# Altium schematic sheet logique.SchDoc
size A3
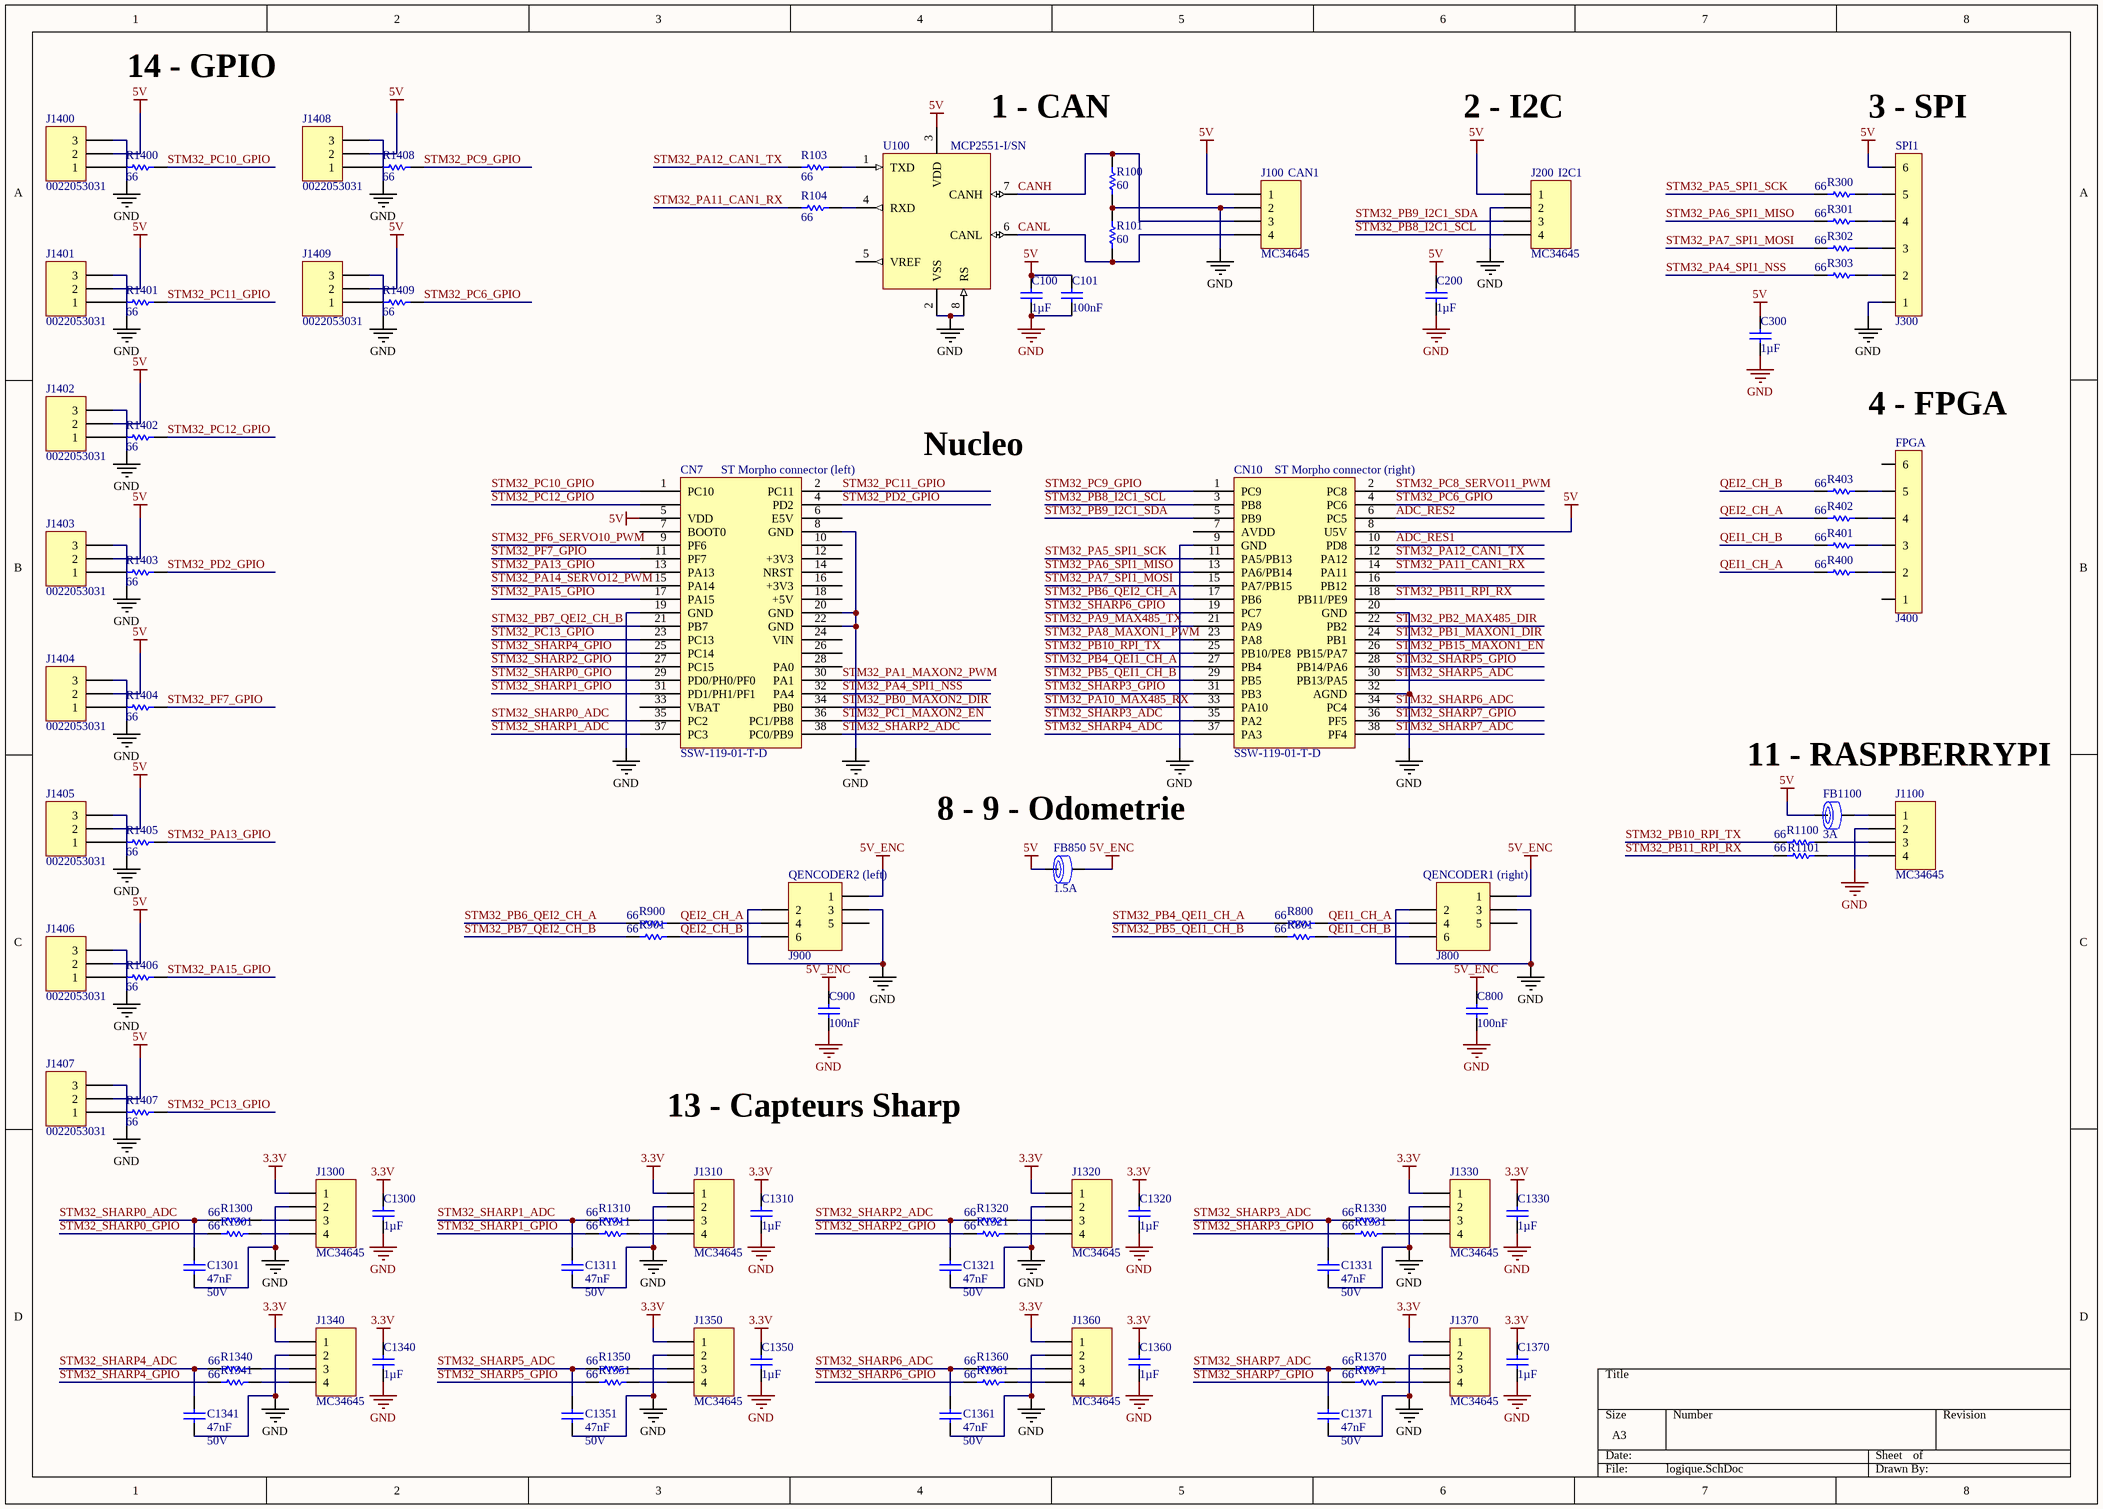
[diagram p0: logique.SchDoc]

## Parts
C100  1µF  [C0805_N]
C101  100nF  [C0805_N]
C200  1µF  [C0805_N]
C300  1µF  [C0805_N]
C800  100nF  [C0805_N]
C900  100nF  [C0805_N]
C1300  1µF  [C0805_N]
C1301  47nF  RatedVoltage: 50V  [WCAP-CSGP_0603, 1.6x0.8x0.8]
C1310  1µF  [C0805_N]
C1311  47nF  RatedVoltage: 50V  [WCAP-CSGP_0603, 1.6x0.8x0.8]
C1320  1µF  [C0805_N]
C1321  47nF  RatedVoltage: 50V  [WCAP-CSGP_0603, 1.6x0.8x0.8]
C1330  1µF  [C0805_N]
C1331  47nF  RatedVoltage: 50V  [WCAP-CSGP_0603, 1.6x0.8x0.8]
C1340  1µF  [C0805_N]
C1341  47nF  RatedVoltage: 50V  [WCAP-CSGP_0603, 1.6x0.8x0.8]
C1350  1µF  [C0805_N]
C1351  47nF  RatedVoltage: 50V  [WCAP-CSGP_0603, 1.6x0.8x0.8]
C1360  1µF  [C0805_N]
C1361  47nF  RatedVoltage: 50V  [WCAP-CSGP_0603, 1.6x0.8x0.8]
C1370  1µF  [C0805_N]
C1371  47nF  RatedVoltage: 50V  [WCAP-CSGP_0603, 1.6x0.8x0.8]
CN7  SSW-119-01-T-D  [CONN RCPT .100" 38POS DUAL TIN]
CN10  SSW-119-01-T-D  [CONN RCPT .100" 38POS DUAL TIN]
FB850  RatedCurrent: 1.5A  [WE-CBF_0603_High Current]  (hidden comment: 742792624)
FB1100  RatedCurrent: 3A  [WE-CBF_0805_High Current]  (hidden comment: 742792023)
J100  MC34645  [HDR1X4]
J200  MC34645  [HDR1X4]
J300  22-03-2061  [22-03-2061]  (value not drawn)
J400  22-03-2061  [22-03-2061]  (value not drawn)
J800  (no value)  [690367280676]
J900  (no value)  [690367280676]
J1100  MC34645  [HDR1X4]
J1300  MC34645  [HDR1X4]
J1310  MC34645  [HDR1X4]
J1320  MC34645  [HDR1X4]
J1330  MC34645  [HDR1X4]
J1340  MC34645  [HDR1X4]
J1350  MC34645  [HDR1X4]
J1360  MC34645  [HDR1X4]
J1370  MC34645  [HDR1X4]
J1400  0022053031  [HDR1X3]
J1401  0022053031  [HDR1X3]
J1402  0022053031  [HDR1X3]
J1403  0022053031  [HDR1X3]
J1404  0022053031  [HDR1X3]
J1405  0022053031  [HDR1X3]
J1406  0022053031  [HDR1X3]
J1407  0022053031  [HDR1X3]
J1408  0022053031  [HDR1X3]
J1409  0022053031  [HDR1X3]
R100  60  [R0805_N]
R101  60  [R0805_N]
R103  66  [R0805_N]
R104  66  [R0805_N]
R300  66  [R0805_N]
R301  66  [R0805_N]
R302  66  [R0805_N]
R303  66  [R0805_N]
R400  66  [R0805_N]
R401  66  [R0805_N]
R402  66  [R0805_N]
R403  66  [R0805_N]
R800  66  [R0805_N]
R801  66  [R0805_N]
R900  66  [R0805_N]
R901  66  [R0805_N]
R1100  66  [R0805_N]
R1101  66  [R0805_N]
R1300  66  [R0805_N]
R1301  66  [R0805_N]
R1310  66  [R0805_N]
R1311  66  [R0805_N]
R1320  66  [R0805_N]
R1321  66  [R0805_N]
R1330  66  [R0805_N]
R1331  66  [R0805_N]
R1340  66  [R0805_N]
R1341  66  [R0805_N]
R1350  66  [R0805_N]
R1351  66  [R0805_N]
R1360  66  [R0805_N]
R1361  66  [R0805_N]
R1370  66  [R0805_N]
R1371  66  [R0805_N]
R1400  66  [R0805_N]
R1401  66  [R0805_N]
R1402  66  [R0805_N]
R1403  66  [R0805_N]
R1404  66  [R0805_N]
R1405  66  [R0805_N]
R1406  66  [R0805_N]
R1407  66  [R0805_N]
R1408  66  [R0805_N]
R1409  66  [R0805_N]
U100  MCP2551-I/SN  [SO8_N]

## Nets
3.3V: C1300.2 C1310.2 C1320.2 C1330.2 C1340.2 C1350.2 C1360.2 C1370.2 J1300.1 J1310.1 J1320.1 J1330.1 J1340.1 J1350.1 J1360.1 J1370.1
5V: C100.2 C101.2 C200.2 C300.2 CN7.5(VDD) CN10.8(U5V) FB850.1 FB1100.1 J100.1 J200.1 J300.6 J1400.2 J1401.2 J1402.2 J1403.2 J1404.2 J1405.2 J1406.2 J1407.2 J1408.2 J1409.2 U100.3(VDD)
5V_ENC: C800.2 C900.2 FB850.2 J800.1 J900.1
GND: C100.1 C101.1 C200.1 C300.1 C800.1 C900.1 C1300.1 C1301.1 C1310.1 C1311.1 C1320.1 C1321.1 C1330.1 C1331.1 C1340.1 C1341.1 C1350.1 C1351.1 C1360.1 C1361.1 C1370.1 C1371.1 CN7.8(GND) CN7.19(GND) CN7.20(GND) CN7.22(GND) CN10.9(GND) CN10.20(GND) CN10.32(AGND) J100.2 J200.2 J300.1 J800.2 J800.3 J900.2 J900.3 J1100.2 J1300.2 J1310.2 J1320.2 J1330.2 J1340.2 J1350.2 J1360.2 J1370.2 J1400.3 J1401.3 J1402.3 J1403.3 J1404.3 J1405.3 J1406.3 J1407.3 J1408.3 J1409.3 R100.1 R101.2 U100.2(VSS) U100.8(RS)
ADC_RES1: CN10.10(PD8)
ADC_RES2: CN10.6(PC5)
CANH: J100.3 R100.2 U100.7(CANH)
CANL: J100.4 R101.1 U100.6(CANL)
QEI1_CH_A: J800.4 R400.2 R800.1
QEI1_CH_B: J800.6 R401.2 R801.1
QEI2_CH_A: J900.4 R402.2 R900.1
QEI2_CH_B: J900.6 R403.2 R901.1
STM32_PA1_MAXON2_PWM: CN7.30(PA1)
STM32_PA4_SPI1_NSS: CN7.32(PA4) R303.2
STM32_PA5_SPI1_SCK: CN10.11(PA5/PB13) R300.2
STM32_PA6_SPI1_MISO: CN10.13(PA6/PB14) R301.2
STM32_PA7_SPI1_MOSI: CN10.15(PA7/PB15) R302.2
STM32_PA8_MAXON1_PWM: CN10.23(PA8)
STM32_PA9_MAX485_TX: CN10.21(PA9)
STM32_PA10_MAX485_RX: CN10.33(PA10)
STM32_PA11_CAN1_RX: CN10.14(PA11) R104.2
STM32_PA12_CAN1_TX: CN10.12(PA12) R103.2
STM32_PA13_GPIO: CN7.13(PA13) R1405.1
STM32_PA14_SERVO12_PWM: CN7.15(PA14)
STM32_PA15_GPIO: CN7.17(PA15) R1406.1
STM32_PB0_MAXON2_DIR: CN7.34(PB0)
STM32_PB1_MAXON1_DIR: CN10.24(PB1)
STM32_PB2_MAX485_DIR: CN10.22(PB2)
STM32_PB4_QEI1_CH_A: CN10.27(PB4) R800.2
STM32_PB5_QEI1_CH_B: CN10.29(PB5) R801.2
STM32_PB6_QEI2_CH_A: CN10.17(PB6) R900.2
STM32_PB7_QEI2_CH_B: CN7.21(PB7) R901.2
STM32_PB8_I2C1_SCL: CN10.3(PB8) J200.4
STM32_PB9_I2C1_SDA: CN10.5(PB9) J200.3
STM32_PB10_RPI_TX: CN10.25(PB10/PE8) R1100.2
STM32_PB11_RPI_RX: CN10.18(PB11/PE9) R1101.2
STM32_PB15_MAXON1_EN: CN10.26(PB15/PA7)
STM32_PC1_MAXON2_EN: CN7.36(PC1/PB8)
STM32_PC6_GPIO: CN10.4(PC6) R1409.1
STM32_PC8_SERVO11_PWM: CN10.2(PC8)
STM32_PC9_GPIO: CN10.1(PC9) R1408.1
STM32_PC10_GPIO: CN7.1(PC10) R1400.1
STM32_PC11_GPIO: CN7.2(PC11) R1401.1
STM32_PC12_GPIO: CN7.3(PC12) R1402.1
STM32_PC13_GPIO: CN7.23(PC13) R1407.1
STM32_PD2_GPIO: CN7.4(PD2) R1403.1
STM32_PF6_SERVO10_PWM: CN7.9(PF6)
STM32_PF7_GPIO: CN7.11(PF7) R1404.1
STM32_SHARP0_ADC: C1301.2 CN7.35(PC2) R1300.2
STM32_SHARP0_GPIO: CN7.29(PD0/PH0/PF0) R1301.2
STM32_SHARP1_ADC: C1311.2 CN7.37(PC3) R1310.2
STM32_SHARP1_GPIO: CN7.31(PD1/PH1/PF1) R1311.2
STM32_SHARP2_ADC: C1321.2 CN7.38(PC0/PB9) R1320.2
STM32_SHARP2_GPIO: CN7.27(PC15) R1321.2
STM32_SHARP3_ADC: C1331.2 CN10.35(PA2) R1330.2
STM32_SHARP3_GPIO: CN10.31(PB3) R1331.2
STM32_SHARP4_ADC: C1341.2 CN10.37(PA3) R1340.2
STM32_SHARP4_GPIO: CN7.25(PC14) R1341.2
STM32_SHARP5_ADC: C1351.2 CN10.30(PB13/PA5) R1350.2
STM32_SHARP5_GPIO: CN10.28(PB14/PA6) R1351.2
STM32_SHARP6_ADC: C1361.2 CN10.34(PC4) R1360.2
STM32_SHARP6_GPIO: CN10.19(PC7) R1361.2
STM32_SHARP7_ADC: C1371.2 CN10.38(PF4) R1370.2
STM32_SHARP7_GPIO: CN10.36(PF5) R1371.2
NetFB1100_2: FB1100.2 J1100.1
NetJ300_2: J300.2 R303.1
NetJ300_3: J300.3 R302.1
NetJ300_4: J300.4 R301.1
NetJ300_5: J300.5 R300.1
NetJ400_2: J400.2 R400.1
NetJ400_3: J400.3 R401.1
NetJ400_4: J400.4 R402.1
NetJ400_5: J400.5 R403.1
NetJ1100_3: J1100.3 R1100.1
NetJ1100_4: J1100.4 R1101.1
NetJ1300_3: J1300.3 R1300.1
NetJ1300_4: J1300.4 R1301.1
NetJ1310_3: J1310.3 R1310.1
NetJ1310_4: J1310.4 R1311.1
NetJ1320_3: J1320.3 R1320.1
NetJ1320_4: J1320.4 R1321.1
NetJ1330_3: J1330.3 R1330.1
NetJ1330_4: J1330.4 R1331.1
NetJ1340_3: J1340.3 R1340.1
NetJ1340_4: J1340.4 R1341.1
NetJ1350_3: J1350.3 R1350.1
NetJ1350_4: J1350.4 R1351.1
NetJ1360_3: J1360.3 R1360.1
NetJ1360_4: J1360.4 R1361.1
NetJ1370_3: J1370.3 R1370.1
NetJ1370_4: J1370.4 R1371.1
NetJ1400_1: J1400.1 R1400.2
NetJ1401_1: J1401.1 R1401.2
NetJ1402_1: J1402.1 R1402.2
NetJ1403_1: J1403.1 R1403.2
NetJ1404_1: J1404.1 R1404.2
NetJ1405_1: J1405.1 R1405.2
NetJ1406_1: J1406.1 R1406.2
NetJ1407_1: J1407.1 R1407.2
NetJ1408_1: J1408.1 R1408.2
NetJ1409_1: J1409.1 R1409.2
NetR103_1: R103.1 U100.1(TXD)
NetR104_1: R104.1 U100.4(RXD)

Not connected (* = marked no-connect by the designer): CN7 6(E5V) 7(BOOT0) 10 12(+3V3) 14(NRST) 16(+3V3) 18(+5V) 24(VIN) 26 28(PA0) 33(VBAT); CN10 7(AVDD) 16(PB12); J400 1 6; J800 5; J900 5; U100 5(VREF)

## Notes on the sheet
- 14 - GPIO
- 1 - CAN
- (near J100) CAN1
- 2 - I2C
- (near J200) I2C1
- (near J300) 3 - SPI
- (near J300) SPI1
- (near J400) 4 - FPGA
- (near J400) FPGA
- (near CN7) ST Morpho connector (left)
- Nucleo
- (near CN10) ST Morpho connector (right)
- 11 - RASPBERRYPI
- 8 - 9 - Odometrie
- (near J900) QENCODER2 (left)
- (near J800) QENCODER1 (right)
- 13 - Capteurs Sharp

## Library data of the parts
C100 C101 C200 C300 C800 C900 C1300 C1310 C1320 C1330 C1340 C1350 C1360 C1370 = Condensateur: Capacitor; Published: 8-Jun-2000; LatestRevisionDate: 17-Jul-2002; LatestRevisionNote: Re-released for DXP Platform.; PackageReference: RAD-0.3; Publisher: Altium Limited
  C100 C200 C300 C1300 C1310 C1320 C1330 C1340 C1350 C1360 C1370: Value: 1µF
  C101 C800 C900: Value: 100nF
C1301 C1311 C1321 C1331 C1341 C1351 C1361 C1371 = WCAP-CSGP, 885012206093: CAP CER 47nF 50V X7R 0603; Manufacturer: Wurth Elektronik; PublishedDate: Aug 2016; ComponentLink1Description: Manufacturer; ComponentLink1URL: http://www.we-online.de; ComponentLink2Description: Datasheet; ComponentLink2URL: http://katalog.we-online.com/pbs/datasheet/885012206093.pdf; Manufacturer Part Number: 885012206093; Value: 47nF; Size: 0603; CeramicType: X7R
CN7 CN10 = SSW-119-01-T-D: CONN RCPT .100" 38POS DUAL TIN; Manufacturer: Samtec Inc.; Supplier 1: Farnell; Supplier Part Number 1: 2667437; Manufacturer Part Number: SSW-119-01-T-D; ComponentLink1URL: http://suddendocs.samtec.com/prints/ssw-1xx-xx-xxx-x-xx-xxx-xx-mkt.pdf; ComponentLink1Description: http://suddendocs.samtec.com/prints/ssw-1xx-xx-xxx-x-xx-xxx-xx-mkt.pdf
FB850 = WE-CBF, 742792624: Ferrite Bead 180ohm 0603 max1.5A; Manufacturer: Wurth Elektronik; Value: 180Ω; Type: High Current; PublishedDate: Aug 2016; ComponentLink1Description: Manufacturer; ComponentLink1URL: http://www.we-online.de; ComponentLink2Description: Datasheet; ComponentLink2URL: http://katalog.we-online.de/pbs/datasheet/742792624.pdf; Manufacturer Part Number: 742792624; Size: 0603
FB1100 = WE-CBF, 742792023: Ferrite Bead 120ohm 0805 max3.0A; Manufacturer: Wurth Elektronik; Value: 120Ω; Type: High Current; PublishedDate: Aug 2016; ComponentLink1Description: Manufacturer; ComponentLink1URL: http://www.we-online.de; ComponentLink2Description: Datasheet; ComponentLink2URL: http://katalog.we-online.de/pbs/datasheet/742792023.pdf; Manufacturer Part Number: 742792023; Size: 0805
J100 J200 J1100 J1300 J1310 J1320 J1330 J1340 J1350 J1360 J1370 = MC34645: MULTICOMP - MC34645 - EMB. MALE COUDEE  CON. MALE 2.54MM 4VOIE; Supplier 1: Farnell; Manufacturer: MULTICOMP; Manufacturer Part Number: MC34645; ComponentLink1URL: http://www.farnell.com/datasheets/1751312.pdf; ComponentLink1Description: http://www.farnell.com/datasheets/1751312.pdf; Pricing: 1=0.597, 5=0.531, 25=0.465, 50=0.399, 100=0.334, 250=0.138 (EUR); Supplier Part Number 1: 1675775
J300 J400 = 22-03-2061: Manufacturer 1: MOLEX; Supplier 1: Farnell; Supplier Part Number 1: 9731113; Manufacturer Part Number: 22-03-2061; Pricing: 10=0.76, 100=0.7, 200=0.64, 500=0.49, 1000=0.43, 2500=0.31, 2500=0.304, 20000=0.298 (EUR); ComponentLink1URL: http://www.farnell.com/cad/1533907.pdf; ComponentLink1Description: http://www.farnell.com/cad/1533907.pdf; ComponentLink2URL: http://www.farnell.com/datasheets/1791310.pdf; ComponentLink2Description: http://www.farnell.com/datasheets/1791310.pdf
J800 J900 = 690367280676: WR-MM Female SMT Connector with Polarization; Manufacturer 1: W¨¹rth Elektronik eiSos GmbH; ComponentLink1 Description: Manufacturer; ComponentLink2 Description: Datasheet; Value: 6; ComponentLink1URL: http://www.we-online.com; ComponentLink2URL: http://katalog.we-online.de/em/datasheet/69036728xx76.pdf; Manufacturer Part Number: 690367280676; Supplier 1: Farnell; Supplier Part Number 1: 1641849
J1400-J1409 = 0022053031: CONN HEADER 3POS .100 R/A TIN; Manufacturer: Molex, LLC; Supplier 1: Farnell; Supplier Part Number 1: 1462932; Manufacturer Part Number: 0022053031; ComponentLink1URL: http://www.molex.com/pdm_docs/sd/022053031_sd.pdf; ComponentLink1Description: http://www.molex.com/pdm_docs/sd/022053031_sd.pdf
R100 R101 = Resistor: Published: 8-Jun-2000; LatestRevisionDate: 17-Jul-2002; LatestRevisionNote: Re-released for DXP Platform.; PackageReference: AXIAL-0.5; Publisher: Altium Limited; Value: 60
R103 R104 R300-R303 R400-R403 R800 R801 R900 R901 R1100 R1101 R1300 R1301 R1310 R1311 R1320 R1321 R1330 R1331 R1340 R1341 R1350 R1351 R1360 R1361 R1370 R1371 R1400-R1409 = Resistor: Value: 10k; Published: 8-Jun-2000; LatestRevisionDate: 17-Jul-2002; LatestRevisionNote: Re-released for DXP Platform.; PackageReference: AXIAL-0.5; Publisher: Altium Limited
U100 = MCP2551-I/SN: IC TRANSCEIVER CAN HI-SPD 8-SOIC; Manufacturer: Microchip Technology; Manufacturer Part Number: MCP2551-I/SN; ComponentLink1Description: Datasheet; ComponentLink1URL: http://www.farnell.com/datasheets/657417.pdf; Supplier 1: Farnell; Supplier Part Number 1: 9758569